# Altium schematic sheet 01_Power.SchDoc
size A; SheetNumber: 2; SheetTotal: 6
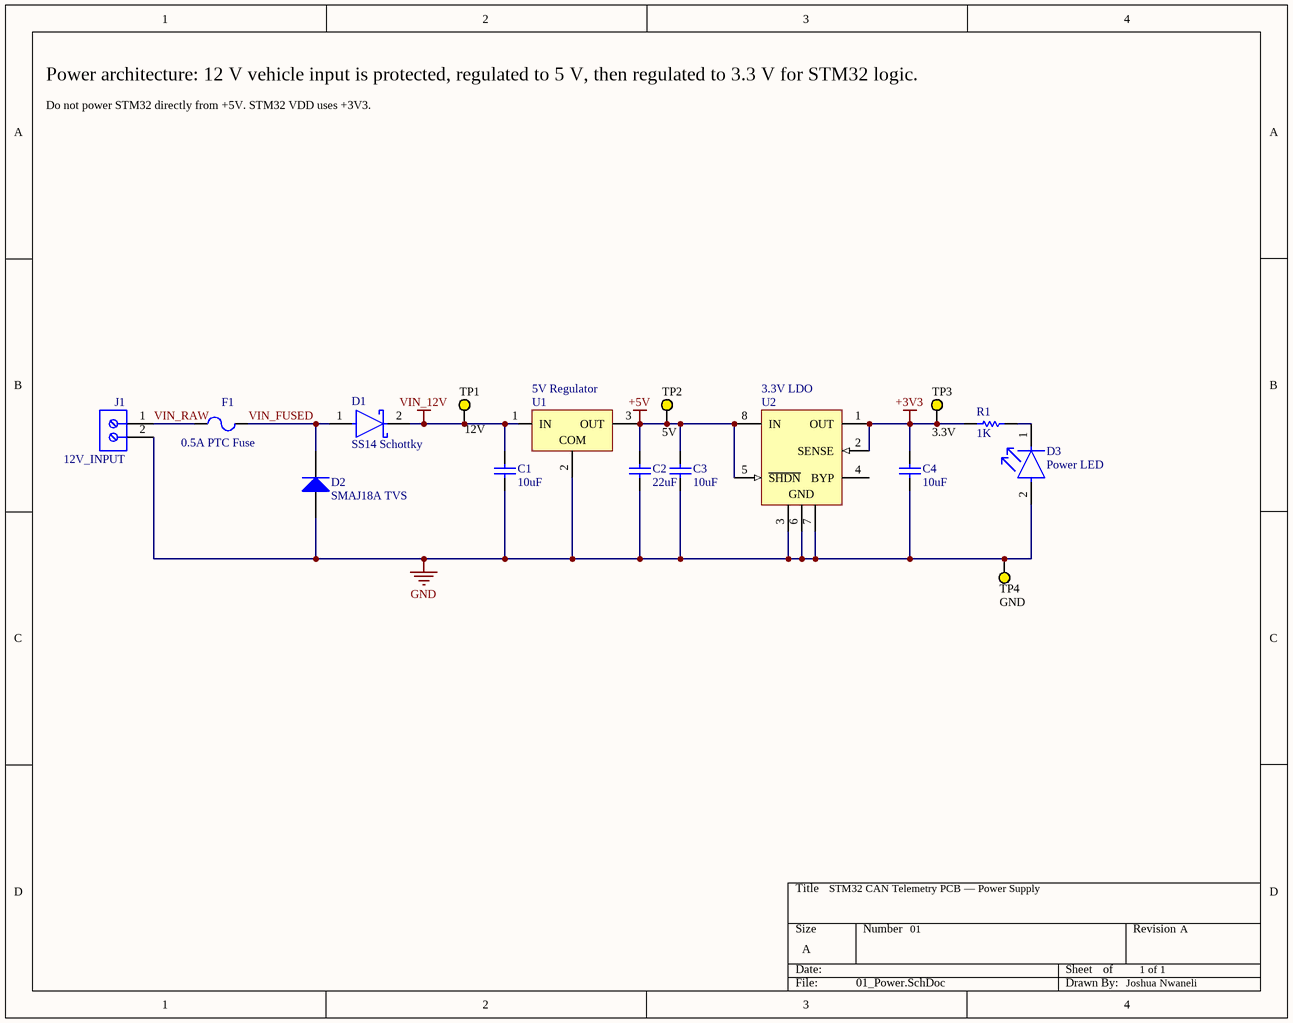
[diagram p0: 01_Power.SchDoc]

## Parts
C1  10uF  [CAPC2013X140X50ML20T25]
C2  22uF  [CAPC1206(3216)190_N]
C3  10uF  [CAPC2013X140X50ML20T25]
C4  10uF  [CAPC2013X140X50ML20T25]
D1  SS14 Schottky  [FP-403AE-MFG]
D2  SMAJ18A TVS  [VISH-DO-214AC-2_M]
D3  Power LED  [FP-SML-LXT0805IW-TR-MFG]
F1  0.5A PTC Fuse  [LFUS-1812L05030PR_V]
J1  12V_INPUT  [691249510002]
R1  1K  [RESC2013X50X30ML20T20]
TP1  12V  [KSTN-5014_V]
TP2  5V  [KSTN-5014_V]
TP3  3.3V  [KSTN-5014_V]
TP4  GND  [KSTN-5014_V]
U1  5V Regulator  [LP3]
U2  3.3V LDO  [LT-S8-8_N]

## Nets
+3V3: C4.2 R1.1 TP3.1 U2.1(OUT) U2.2(SENSE)
+5V: C2.1 C3.2 TP2.1 U1.3(OUT) U2.5(~{SHDN}) U2.8(IN)
GND: C1.1 C2.2 C3.1 C4.1 D2.2(A) D3.2(A) J1.2 TP4.1 U1.2(COM) U2.3(GND) U2.6(GND) U2.7(GND)
VIN_12V: C1.2 D1.2(C) TP1.1 U1.1(IN)
VIN_FUSED: D1.1(A) D2.1(K) F1.2
VIN_RAW: F1.1 J1.1
NetD3_1: D3.1(C) R1.2

Not connected (* = marked no-connect by the designer): U2 4(BYP)

## Notes on the sheet
- Power architecture: 12 V vehicle input is protected, regulated to 5 V, then regulated to 3.3 V for STM32 logic.
- Do not power STM32 directly from +5V. STM32 VDD uses +3V3.
- STM32 CAN Telemetry PCB — Power Supply
- 01
- 1 of 1
- A
- Joshua Nwaneli

## Library data of the parts
C1 C3 C4 = CMP-2007-04702-1: Manufacturer: AVX Interconnect / Elco; Part Number: 0805ZC106KAT2A
C2 = CMP-1037-04990-1: CAP 22uF 10V ±20% 1206 (3216 Metric) Thickness 1.9mm SMD; Tolerance: Â±20%; Case-EIA: 1206; Case-Metric: 3216; Rated Voltage: 10 V; Max Thickness: 1.9 mm; Technology: SMT; Value: 22uF
D1 = CMP-2000-04943-2: DIODE SCHOTTKY 40V 1A SMA; Manufacturer: ON Semiconductor; Peak Reverse Current: 0.2mA; Max Junction Temp: +125°C; Standoff Height: 0.05mm; Max Surge Forward Current: 40A; Mouser Description: Schottky Diodes & Rectifiers SMA 40V 1.0A; RoHS: TRUE; Lead Free: Yes; Manufacturer Part Number: SS14; Device Class L3: Schottky Diodes; Category: Diode; Automotive: No; Digikey Description: DIODE SCHOTTKY 40V 1A SMA; ComponentLink2Description: Datasheet; Device Class L2: Diodes; Height: 2.5mm; Temperature Range High: +125°C; ComponentLink2URL: https://www.onsemi.com/pub/Collateral/SS19-D.PDF; Device Class L1: Discrete Semiconductors; Package: 403AE; Octopart: https://octopart.com/ss14-on+semiconductor-29205033; Max Repetitive Reverse Voltage: 40V; Temperature Range Low: -65°C; Forward Current: 1A; Temperature: -65°C to +125°C
D2 = CMP-0548-00222-2: Transient Voltage Suppressor, 6.40 to 231 V, 18 V Stand-off Voltage, Uni-Directional, -55 to 155 degC, 2-pin DO-214AC, Pb-Free, Tape and Reel; Manufacturer: Vishay Semiconductor; PartNumber: SMAJ18A-E3/61; IFSM: 40 A; PPPM (W): 400, 300; ID (uA): 1; VWM (V): 18; VBR Uni-Directional (V): 6.4 to 231; ComponentLink1URL: http://www.vishay.com/; ComponentLink3URL: http://www.vishay.com/docs/88390/smaj50a.pdf; RoHS: TRUE; Operating Junction and Storage Temperature Range: -55 to 150 degC; ComponentLink2URL: http://www.vishay.com/docs/88390/smaj50a.pdf; ComponentLink1Description: Manufacturer URL; Mounting Technology: Surface Mount; DatasheetVersion: 12/8/2013; PackageDescription: 2-Pin DO-214AC (SMA), Body 4.245 x 2.665 mm; Packing: Tape and Reel; ComponentLink3Description: Package Specification; ComponentLink2Description: Datasheet; PackageReference: DO-214AC-2
D3 = CMP-1724-00002-2: LED RED DIFFUSED SMD; Lens Style: Rectangular; Luminous Intensity: 11mcd; Approvals: UL; Test Current: 20mA; Forward Voltage: 2V; Number of LEDs: 1; Wavelength: 635nm; Lens Color: White; Viewing Angle: 140°; Min Operating Temperature: -25°C; Case Code (Metric): 2012; Mount: Surface Mount; Case Code (Imperial): 0805; Height: 0.8mm; Lead Free: Lead Free; Color: Red; Package Quantity: 1; Illumination Color: Red; Lens Transparency: Diffused; Forward Current: 20mA; Packaging: Tape and Reel; Length: 2mm; Case/Package: 0805; REACH SVHC: No SVHC; Width: 1.25mm; Number of Pins: 2; Max Operating Temperature: 80°C; Dominant Wavelength: 635nm
F1 = CMP-2000-05508-1: PTC Resettable Fuse, 0.8 W, 30 V, -40 to 85 degC, 2-Pin SMD, RoHS, Tape and Reel; Manufacturer: Littelfuse-Inc.; Voltage - Max: 30V; Current - Hold (Ih) (Max): 500mA; Time to Trip: 0.15s; Current - Max: 100A; R Min/Max: 0.150~1.000Ohm; Current - Trip (It): 1A; Package Reference: 1812; Family: PTCResettableFuses; Packaging: Tape&Reel(TR); Package / Case: 1812(4532Metric),Concave; Series: POLY-FUSE®,1812L; Mounting Technology: SurfaceMount; Datasheet Version: 02/2016; Datasheet URL: http://www.littelfuse.com/~/media/electronics/datasheets/resettable_ptcs/littelfuse_ptc_1812l_datasheet.pdf.pdf; Manufacturer URL: http://www.littelfuse.com/; Category: CircuitProtection; Package Description: 2-Pin Surface Mount Device, Body 4.55 x 3.24 mm
J1 = CMP-03913-78871301-2: Terminal Block, 5.08MM Pitch, Double Level Horizontal, 12-30 AWG, 2 Pin; Lead Pitch: 5.08mm; Number of Pins: 2; Packaging: Box
R1 = CMP-2001-04268-1: Manufacturer: Vishay Dale; Part Number: CRCW08051K00FKTC
TP1 = CMP-1672-00006-4: 12V Test Point; Manufacturer: Keystone; PackageDescription: 1-Pin Through Hole Device, Dia 3.17 mm; REACH SVHC: No SVHC; ComponentLink2Description: Datasheet; ComponentLink2URL: http://www.keyelco.com/product-pdf.cfm?p=1323; Package Quantity: 100; Colour: Yellow; Height: 8.12 mm; RoHSCompliant: true; Contact Material: Bronze; Mount: Through Hole; Contact Plating: Silver; ComponentLink1URL: http://www.keyelco.com/; Packaging: Bulk; Mounting Technology: Through Hole; PackageReference: 5014; ComponentLink1Description: Manufacturer URL; DatasheetVersion: Rev. F, 12/2013
TP2 = CMP-1672-00006-4: 5V Test Point; Manufacturer: Keystone; PackageDescription: 1-Pin Through Hole Device, Dia 3.17 mm; REACH SVHC: No SVHC; ComponentLink2Description: Datasheet; ComponentLink2URL: http://www.keyelco.com/product-pdf.cfm?p=1323; Package Quantity: 100; Colour: Yellow; Height: 8.12 mm; RoHSCompliant: true; Contact Material: Bronze; Mount: Through Hole; Contact Plating: Silver; ComponentLink1URL: http://www.keyelco.com/; Packaging: Bulk; Mounting Technology: Through Hole; PackageReference: 5014; ComponentLink1Description: Manufacturer URL; DatasheetVersion: Rev. F, 12/2013
TP3 = CMP-1672-00006-4: 3.3V Test Point; Manufacturer: Keystone; PackageDescription: 1-Pin Through Hole Device, Dia 3.17 mm; REACH SVHC: No SVHC; ComponentLink2Description: Datasheet; ComponentLink2URL: http://www.keyelco.com/product-pdf.cfm?p=1323; Package Quantity: 100; Colour: Yellow; Height: 8.12 mm; RoHSCompliant: true; Contact Material: Bronze; Mount: Through Hole; Contact Plating: Silver; ComponentLink1URL: http://www.keyelco.com/; Packaging: Bulk; Mounting Technology: Through Hole; PackageReference: 5014; ComponentLink1Description: Manufacturer URL; DatasheetVersion: Rev. F, 12/2013
TP4 = CMP-1672-00006-4: Ground Test Point; Manufacturer: Keystone; PackageDescription: 1-Pin Through Hole Device, Dia 3.17 mm; REACH SVHC: No SVHC; ComponentLink2Description: Datasheet; ComponentLink2URL: http://www.keyelco.com/product-pdf.cfm?p=1323; Package Quantity: 100; Colour: Yellow; Height: 8.12 mm; RoHSCompliant: true; Contact Material: Bronze; Mount: Through Hole; Contact Plating: Silver; ComponentLink1URL: http://www.keyelco.com/; Packaging: Bulk; Mounting Technology: Through Hole; PackageReference: 5014; ComponentLink1Description: Manufacturer URL; DatasheetVersion: Rev. F, 12/2013
U1 = CMP-0324-00078-1: Regulates protected 12V input down to 5V; PartNumber: UA78M05IKCSE3; Manufacturer: Texas Instruments; Vout(Max)(V): 5; Eco-Plan: Pb-Free (RoHS); Iout(Max)(A): 0.5; Iq(Typ)(mA): 6; Vin(Max)(V): 25; Vin(Min)(V): 7; ComponentLink2Description: URL Link1; PackageDescription: Plastic Cylindrical Package, Formed Lead Option (TO-92); Mounting Technology: Through Hole; Vout(Min)(V): 5; PackageVersion: revC, Oct-2001; PackageReference: LP3; Code_JEDEC: TO-226-AA; ComponentLink1URL: http://www.ti.com/general/docs/lit/getliterature.tsp?genericPartNumber=UA78M05&fileType=pdf; DatasheetVersion: SLVS059Q; ComponentLink2URL: Samples URL:http://www.ti.com/product/ua78m05#samples; ComponentLink1Description: Datasheet
U2 = CMP-0476-01566-1: 500 mA, Low Noise, LDO Micropower Regulator, 1.8 to 20 V Vin, 3.3 V Vout, 8-pin SOIC (S8-8), -40 to 125 degC, Pb-Free; Manufacturer: Linear Technology; PartNumber: LT1763IS8-3.3#PBF; Shutdown Current(uA): 1; Vin Min(V): 1.8; Iout(mA): 500; Noise(uV): 20; Isupply(mA): 0.03; Discrete Pass Element: no; PSRR(dB): 65; Dropout Voltage(V): 0.3; ComponentLink3URL: http://cds.linear.com/docs/en/packaging/05081610_G_SO8.pdf; Number of Outputs: 1; ComponentLink2URL: http://cds.linear.com/docs/en/datasheet/1763fg.pdf; ComponentLink1Description: Manufacturer URL; PackageReference: S8-8; DatasheetVersion: Rev. G; ComponentLink3Description: Package Specification; ComponentLink2Description: Datasheet; Output Voltage: 3.3 V; Mounting Technology: Surface Mount; Vin Max(V): 20; ComponentLink1URL: http://www.linear.com/; PackageDescription: 8-Pin Plastic Small Outline (Narrow .150 Inch), Body 4.9 x 3.9 mm, Pitch 1.27 mm; RoHS: TRUE; PackageVersion: Rev. G, 03/2012